# EAGLE design receiver (EAGLE 8.7.0)
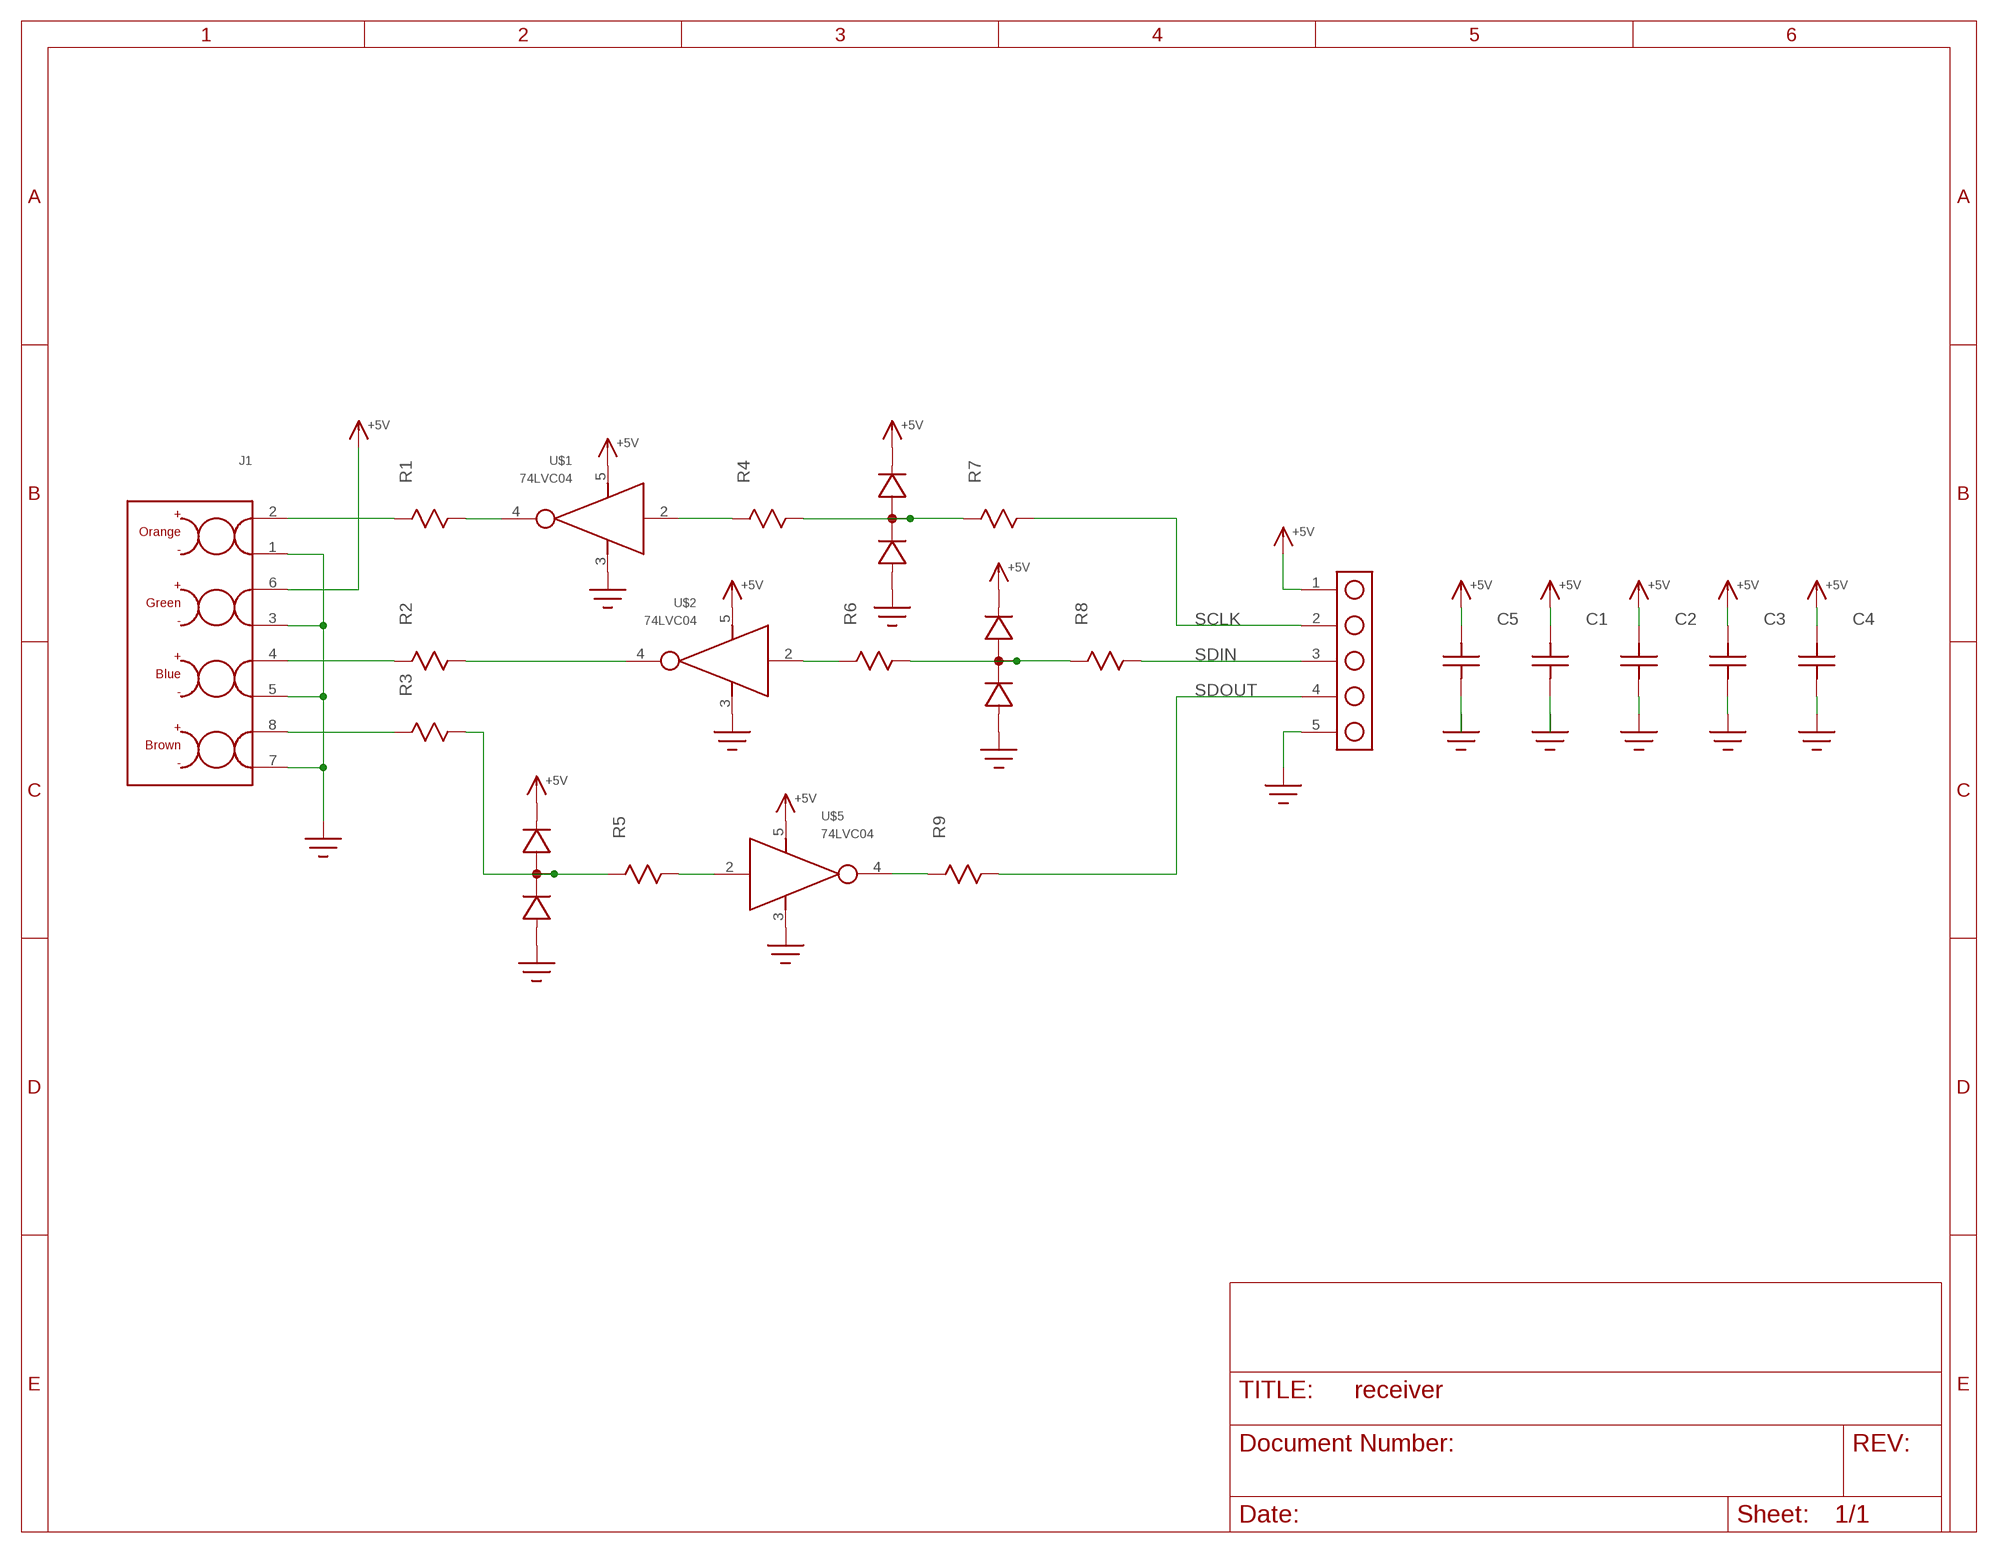
[diagram p0: schematic, sheet 1]

## Parts
C1  C1206  [1206]
C2  C0805  [0805]
C3  C0805  [0805]
C4  C0805  [0805]
C5  C1206  [1206]
J1  RJ45  [RJ45_KEYSTONE_949]
J2  HEADER_5PIN  [HEADER_5PIN]
R1  R0805  [R0805]
R2  R0805  [R0805]
R3  R0805  [R0805]
R4  R0805  [R0805]
R5  R0805  [R0805]
R6  R0805  [R0805]
R7  R0805  [R0805]
R8  R0805  [R0805]
R9  R0805  [R0805]
U$1  74LVC04  [SOT23-5]
U$2  74LVC04  [SOT23-5]
U$5  74LVC04  [SOT23-5]
U$12  MMBD7000L  [SOT-23]
U$13  MMBD7000L  [SOT-23]
U$14  MMBD7000L  [SOT-23]

## Nets
+5V: C1.P$2 C2.P$2 C3.P$2 C4.P$2 C5.P$2 J1.6 J2.1 U$1.5(VCC) U$2.5(VCC) U$5.5(VCC) U$12.2(CATHODE) U$13.2(CATHODE) U$14.2(CATHODE)
GND: C1.P$1 C2.P$1 C3.P$1 C4.P$1 C5.P$1 J1.1 J1.3 J1.5 J1.7 J2.5 U$1.3(GND) U$2.3(GND) U$5.3(GND) U$12.1(ANODE) U$13.1(ANODE) U$14.1(ANODE)
N$1: J1.2 R1.P$1
N$2: R1.P$2 U$1.4(OUT)
N$3: J1.4 R2.P$1
N$4: R2.P$2 U$2.4(OUT)
N$5: J1.8 R3.P$1
N$6: R3.P$2 R5.P$1 U$14.3(COMMON)
N$7: R5.P$2 U$5.2(IN)
N$8: R6.P$1 U$2.2(IN)
N$9: R4.P$1 U$1.2(IN)
N$10: R4.P$2 R7.P$1 U$12.3(COMMON)
N$11: R6.P$2 R8.P$1 U$13.3(COMMON)
N$12: R9.P$1 U$5.4(OUT)
SCLK: J2.2 R7.P$2
SDIN: J2.3 R8.P$2
SDOUT: J2.4 R9.P$2

## Library data of the parts
C1-C5 = pancam:C
J1 = pancam:RJ45
J2 = pancam:HEADER_5PIN
R1-R9 = pancam:R
U$1 U$2 U$5 = pancam:74LVC04
U$12-U$14 = pancam:MMBD7000L

## Board
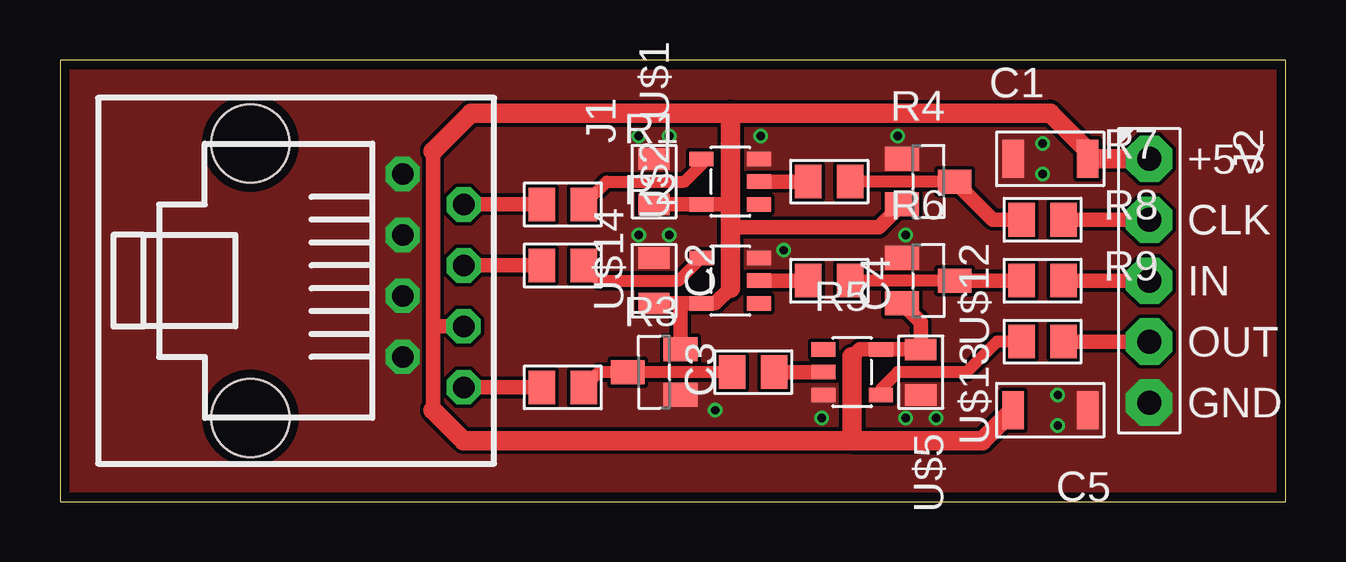
[diagram p1: board, top side]
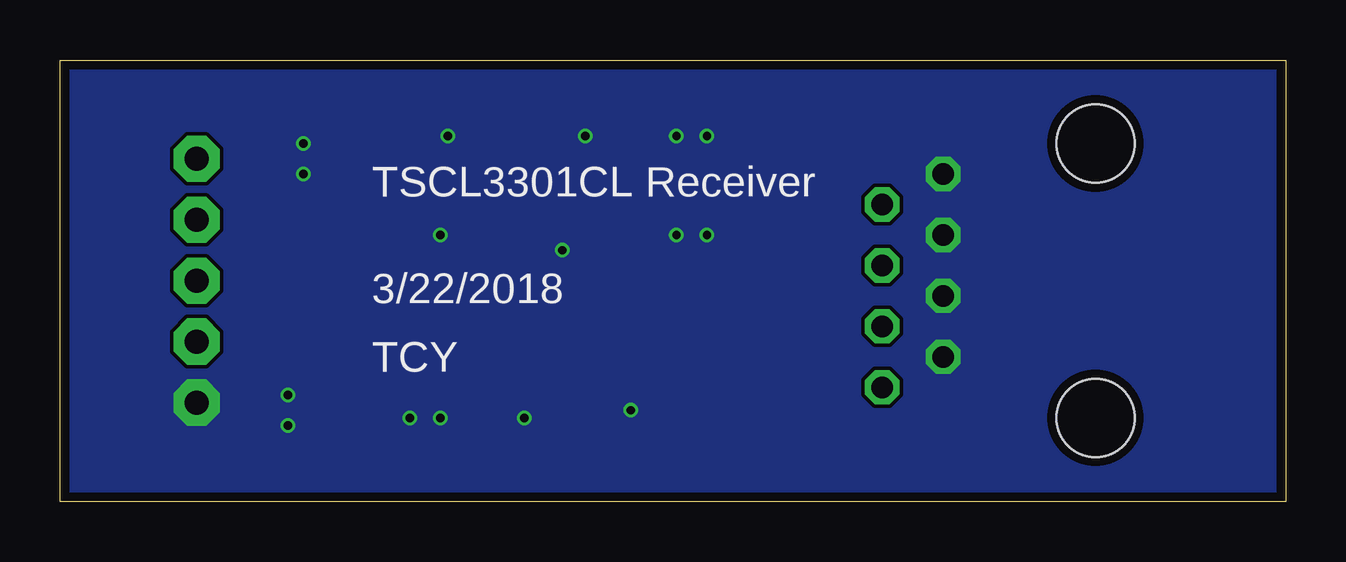
[diagram p2: board, bottom side, seen from below]

Size 51.1 x 18.4 mm. Coordinates in mm from the lower left corner, seen from the top.
Outline: 0,0 51.1,0 51.1,18.4 0,18.4 0,0
Copper layers (1*16): Top 0.035559375mm / dielectric 1.6mm / Bottom 0.035559375mm
Design rules "oshpark-2layer": minimum track width 6mil, minimum drill 10mil, track to track 6mil, track to pad 6mil, pad to pad 6mil, via to via 6mil, smd to smd 6mil, copper to edge 15mil, drill to drill 6mil, minimum pad ring 5mil, minimum via ring 5mil, stop-mask expansion 2.5mil, vias tented up to drill 0mil, thermal gap 10mil

### Footprints (pad centres in the part's own frame; a part is rotated, then mirrored left to right if it is on the bottom)
1206 = smd 0.9 x 1.6: P$1 -1.55,0; P$2 1.55,0
0805 = smd 0.9 x 1.3: P$1 -0.95,0; P$2 0.95,0
RJ45_KEYSTONE_949 = drill 0.9 pad 1.422 octagon: 1 -4.445,0; 2 -3.175,2.54; 3 -1.905,0; 4 -0.635,2.54; 5 0.635,0; 6 1.905,2.54; 7 3.175,0; 8 4.445,2.54 | hole 3.251: -5.715,-6.35; 5.715,-6.35
HEADER_5PIN = drill 1 pad 1.93 octagon: 1 -5.08,0; 2 -2.54,0; 3 0,0; 4 2.54,0; 5 5.08,0
R0805 = smd 1.1 x 1.4: P$1 -0.875,0; P$2 0.875,0
SOT23-5 = smd 0.6 x 1: 1 -0.95,-1.2; 2 0,-1.2; 3 0.95,-1.2; 4 0.95,1.2; 5 -0.95,1.2
SOT-23 = smd 1 x 1.4: 1 -0.95,-1.1; 2 0.95,-1.1; 3 0,1.1

### Placement (x,y rotation side)
C1  41.27,14.29 0 top
C2  24.77,13.34 270 top
C3  24.77,9.21 270 top
C4  35.88,5.4 90 top
C5  41.27,3.81 180 top
J1  14.29,9.21 270 top
J2  45.4,9.21 270 top
R1  20.95,12.38 0 top
R2  20.95,9.84 0 top
R3  20.95,4.76 0 top
R4  32.07,13.34 0 top
R5  28.89,5.4 0 top
R6  32.07,9.21 0 top
R7  40.96,11.75 0 top
R8  40.96,9.21 0 top
R9  40.96,6.67 0 top
U$1  27.94,13.34 90 top
U$2  27.94,9.21 90 top
U$5  33.02,5.4 270 top
U$12  36.2,13.34 270 top
U$13  36.2,9.21 270 top
U$14  24.77,5.4 90 top

### Tracks (layer width: path | path; a pad name or v marks a point on that pad's centre or on a via)
+5V
  Top 0.61: C2.P$2 U$1.5 27.94,12.38 | 25.72,8.26 U$2.5 27.31,8.26 27.94,8.89 | 25.72,8.26 C3.P$2 | J1.6 15.56,7.3 | 15.56,7.3 15.56,14.61 | U$14.2 25.86,8.11 25.72,8.26 | 27.94,11.43 34.14,11.43 U$12.2 | U$13.2 35.88,7.47 C4.P$2 U$5.5 33.34,6.35 33.02,6.03 | 15.56,3.81 15.56,7.3
  Top 0.813: J2.1 C1.P$2 42.83,14.64 41.27,16.19 27.94,16.19 | 15.56,14.61 17.14,16.19 27.94,16.19 | 27.94,16.19 27.94,12.38 27.94,11.43 27.94,8.89 | C5.P$2 38.45,2.54 33.02,2.54 | 33.02,6.03 33.02,2.54 | 33.02,2.54 16.83,2.54 15.56,3.81
GND  (via drill 0.35)
  other vias: 27.3,3.81 31.75,3.49 35.24,3.49 36.51,3.49 24.13,11.11 25.4,11.11 24.13,15.24 25.4,15.24 34.92,15.24 35.24,11.11 30.16,10.48 29.21,15.24 40.96,14.92 40.96,13.65 41.59,4.45 41.59,3.17
  pour Top (no thermals): 0,0 51.12,0 51.12,18.41 0,18.41
  pour Bottom (no thermals): 0,0 51.12,0 51.12,18.41 0,18.41
N$1
  Top 0.61: R1.P$1 J1.2
N$2
  Top 0.508: R1.P$2 22.78,13.34 26.04,13.34 26.74,14.04 U$1.4
N$3
  Top 0.61: J1.4 R2.P$1
N$4
  Top 0.508: R2.P$2 22.46,9.21 25.79,9.21 U$2.4
N$5
  Top 0.61: J1.8 R3.P$1
N$6
  Top 0.508: R5.P$1 U$14.3 22.46,5.4 R3.P$2
N$7
  Top 0.61: U$5.2 R5.P$2
N$8
  Top 0.61: R6.P$1 U$2.2
N$9
  Top 0.61: R4.P$1 U$1.2
N$10
  Top 0.508: U$12.3 R4.P$2
  Top 0.61: R7.P$1 38.88,11.75 U$12.3
N$11
  Top 0.508: U$13.3 R6.P$2
  Top 0.61: R8.P$1 U$13.3
N$12
  Top 0.508: R9.P$1 39.05,6.67 37.78,5.4 34.92,5.4 34.22,4.69 U$5.4
SCLK
  Top 0.61: J2.2 R7.P$2
SDIN
  Top 0.61: R8.P$2 J2.3
SDOUT
  Top 0.61: J2.4 R9.P$2

### Text on the board
tPlace: +5V | CLK | IN | OUT | GND
bPlace: TSCL3301CL Receiver | 3/22/2018 | TCY